# Altium project RoboRIOSPIBreakout.PrjPcb
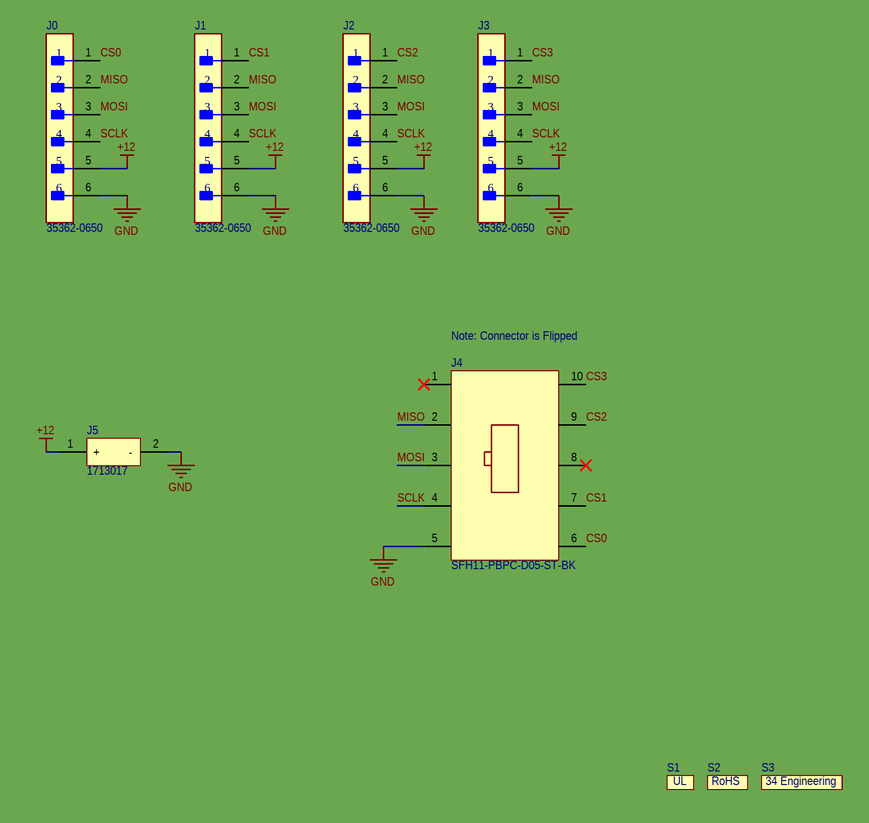
[diagram p0: RoboRIOSPIBreakout.SchDoc]
1 sheet, 9 parts. Net scope: global (net labels, ports and power ports of the same name join across sheets).
Board file: RoboRIOSPIBreakout.PcbDoc

## Sheet RoboRIOSPIBreakout.SchDoc
size A; SheetNumber: 1; SheetTotal: 1

### Parts
J0  35362-0650  [FP-35362-0650-MFG]
J1  35362-0650  [FP-35362-0650-MFG]
J2  35362-0650  [FP-35362-0650-MFG]
J3  35362-0650  [FP-35362-0650-MFG]
J4  SFH11-PBPC-D05-ST-BK  [SFH11-PBPC-D05-ST-BK]
J5  1713017  [1713017]
S1  (no value)  [UL]
S2  (no value)  [RoHS]
S3  (no value)  [34EngineeringLogo]

### Nets
+12: J0.5 J1.5 J2.5 J3.5 J5.1(+)
GND: J0.6 J1.6 J2.6 J3.6 J4.5 J5.2(-)
CS0: J0.1 J4.6
CS1: J1.1 J4.7
CS2: J2.1 J4.9
CS3: J3.1 J4.10
MISO: J0.2 J1.2 J2.2 J3.2 J4.2
MOSI: J0.3 J1.3 J2.3 J3.3 J4.3
SCLK: J0.4 J1.4 J2.4 J3.4 J4.4

Not connected (* = marked no-connect by the designer): J4 1* 8*

### Notes on the sheet
- (near J4) Note: Connector is Flipped
- (in symbol 34EngineeringLogo) 34 Engineering

### Library data of the parts
J0-J3 = CMP-04776-000268-1: CONN HEADER VERT 6POS 2MM; Max Voltage Rating (DC): 125.125kV; Contact Resistance: 20mR; Insulation Resistance: 1GR; Gender: Male; Current Rating: 2A; Number of Positions: 6; Glow Wire Compliant: Non-compliant; Voltage Rating (AC): 125V; Housing Color: Natural; Contact Material: Brass; Series: 35362; Length: 14.3mm; Width: 16.3mm; Packaging: Bulk; Lead Pitch: 2mm; Contact Plating: Tin; Flammability Rating: UL94 V-0; Max Current Rating: 2A; Height: 8.5mm; Depth: 5.5mm; Package Quantity: 1000; Radiation Hardening: No; Max Operating Temperature: 105°C; Number of Circuits: 6; Number of Contacts: 6; Number of Poles: 6; Housing Material: Nylon; Number of Rows: 1; Halogen Free: Low Halogen; Mount: Through Hole; Color: Natural; Voltage Rating: 125V; Min Operating Temperature: -40°C; Lead Free: Lead Free; Termination: Solder; Orientation: Vertical; Voltage Rating (DC): 125V; Pitch: 2mm
J4 = SFH11-PBPC-D05-ST-BK: Female, 10C, Straight .100"CC; No Mt. w/Center Polarizing Key; PBT, Brass, Gold Flash, 105 C; Manufacturer: Sullins; Number of Positions: 10; Connector Type: Header; Pitch: 0.1inch; Supplier 1: Digi-Key; Manufacturer Part Number: SFH11-PBPC-D05-ST-BK; RoHS: Yes; Category: Connectors; Stock 1: 44672; Pricing 1: 1=0.66000, 10=0.55300, 80=0.49700, 440=0.40661, 1000=0.36144, 5000=0.32630 (USD); Mount: Through Hole; Color: Black; Contact Plating: Gold; Package Quantity: 1; Number of Rows: 2; Packaging: Tray; Termination: Solder; Series: SFH11; Contact Type: Female Socket; Row Spacing: 0.1inch; Lead Free: Lead Free; RoHS Compliant: Yes; ComponentLink1URL: https://datasheet.ciiva.com/754/sfh11-pxxc-dxx-st-xx11160-c-754555.pdf?src-supplier=Digi-Key; ComponentLink1Description: https://datasheet.ciiva.com/754/sfh11-pxxc-dxx-st-xx11160-c-754555.pdf?src-supplier=Digi-Key; Supplier Part Number 1: S9194-ND
J5 = 1713017: PCB Terminal Push-In 3.5mm 16AWG 250V 8A 2 Position Combicon Compact Series; Manufacturer: Phoenix Contact; Number of Levels: 1; Number of Positions Per Level: 2; Current: 2A; Voltage: 300V; Wire Gauge (Max): 24AWG; Pitch: 0.138inch; Supplier 1: Arrow Electronics; Manufacturer Part Number: 1713017; RoHS: Yes; Category: Terminal Blocks; Stock 1: 1500; Pricing 1: 1=0.37150, 10=0.35410, 25=0.34670, 50=0.33270, 100=0.32070, 250=0.29670, 500=0.28610, 1000=0.28220 (USD); Mount: Through Hole; Weight: 0.038801oz; Color: Multiple; Package Quantity: 1; Packaging: Bulk; Current Rating: 8A; Voltage Rating: 250V; Termination: Screwless; Number of Positions: 2; Series: COMBICON PTSA; Length: 12mm; Height: 13.1mm; Wire Gauge (Min): 16AWG; Lead Free: Lead Free; RoHS Compliant: Yes; ComponentLink1URL: https://datasheet.ciiva.com/18620/1713017-18620870.pdf?src-supplier=Digi-Key; ComponentLink1Description: https://datasheet.ciiva.com/18620/1713017-18620870.pdf?src-supplier=Digi-Key; Supplier Part Number 1: 1713017
S1 = UL
S2 = RoHS
S3 = 34EngineeringLogo: 34 Engineering Silkscreen Logo